# Altium project Ada4Arm.PrjPCB
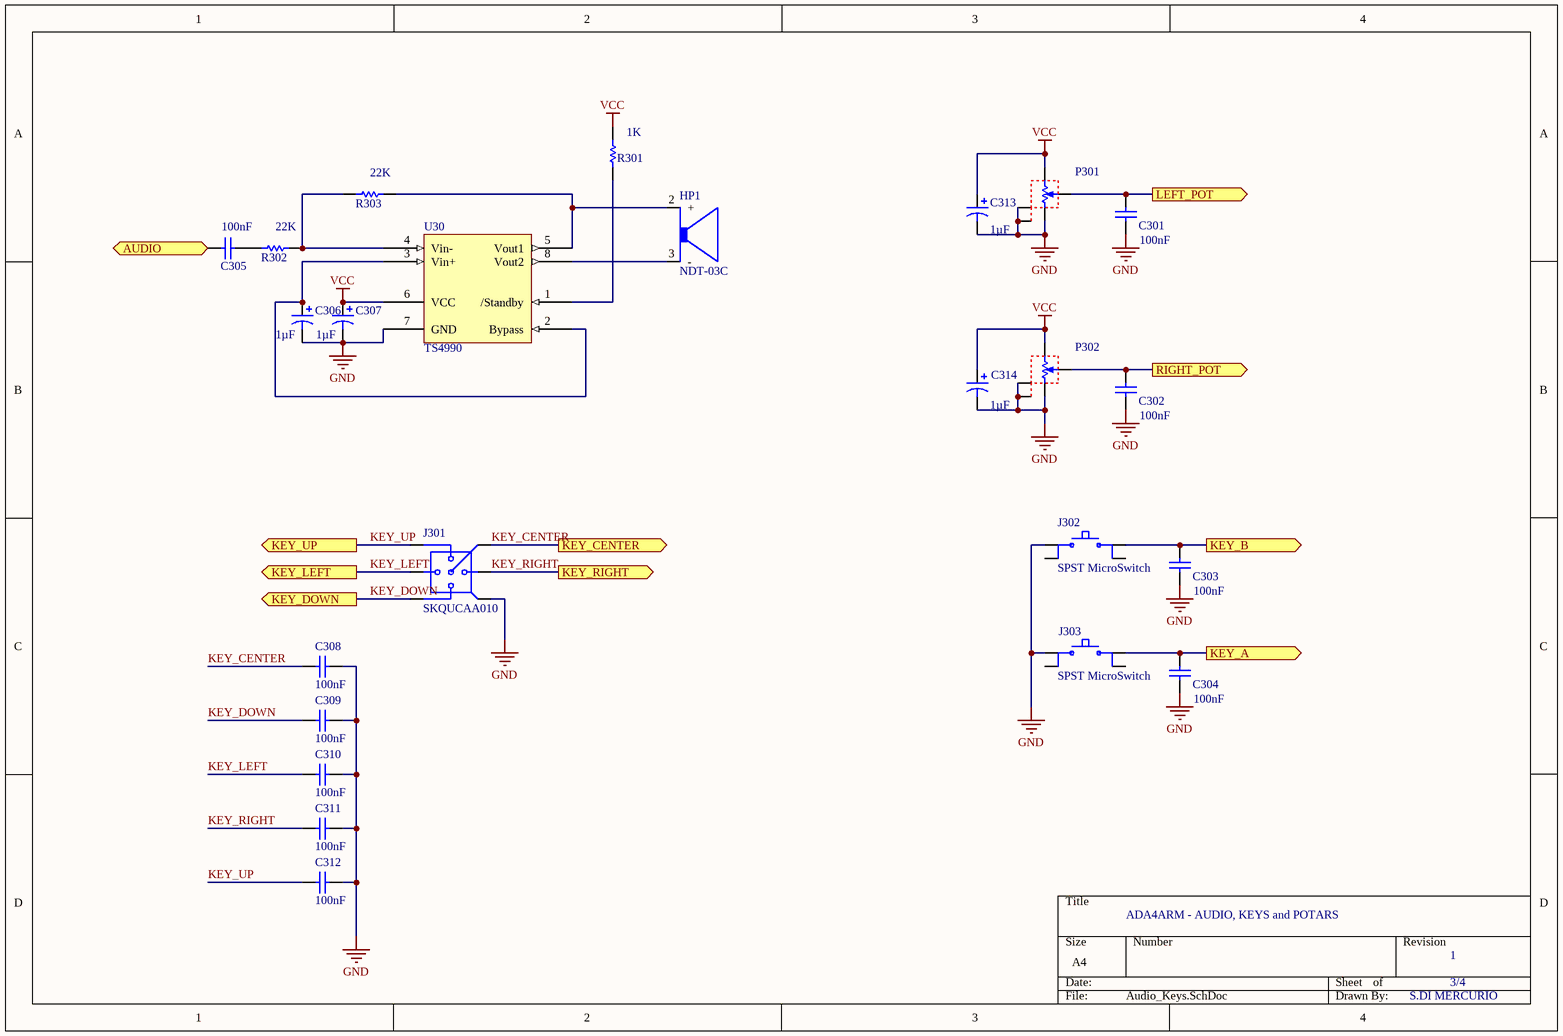
[diagram p0: Audio_Keys.SchDoc]
2 sheets, 41 parts. Net scope: flat (ports and power ports of the same name join across sheets).
Board file: PCB_Hammond_1591GSGY-v3B.PcbDoc
Sheets:
  Audio_Keys.SchDoc
  Power_Debug.SchDoc

## Sheet Audio_Keys.SchDoc
size A4

### Parts
C301  value 100nF  [CAPC1206(3216)100_N]  (hidden comment: CAP 100nF 16V 1206(3216))
C302  value 100nF  [CAPC1206(3216)100_N]  (hidden comment: CAP 100nF 16V 1206(3216))
C303  value 100nF  [CAPC1206(3216)100_N]  (hidden comment: CAP 100nF 16V 1206(3216))
C304  value 100nF  [CAPC1206(3216)100_N]  (hidden comment: CAP 100nF 16V 1206(3216))
C305  value 100nF  [CAPC1206(3216)100_N]  (hidden comment: CAP 100nF 16V 1206(3216))
C306  value 1µF  [EAI 3216-18 A]  (hidden comment: Cap Pol3)
C307  value 1µF  [EAI 3216-18 A]  (hidden comment: Cap Pol3)
C308  value 100nF  [CAPC1206(3216)100_N]  (hidden comment: CAP 100nF 16V 1206(3216))
C309  value 100nF  [CAPC1206(3216)100_N]  (hidden comment: CAP 100nF 16V 1206(3216))
C310  value 100nF  [CAPC1206(3216)100_N]  (hidden comment: CAP 100nF 16V 1206(3216))
C311  value 100nF  [CAPC1206(3216)100_N]  (hidden comment: CAP 100nF 16V 1206(3216))
C312  value 100nF  [CAPC1206(3216)100_N]  (hidden comment: CAP 100nF 16V 1206(3216))
C313  value 1µF  [EAI 3216-18 A]  (hidden comment: Cap Pol3)
C314  value 1µF  [EAI 3216-18 A]  (hidden comment: Cap Pol3)
HP1  NDT-03C  [KAAG15008C]
J301  SKQUCAA010  [SKQUCAA010]
J302  SPST MicroSwitch  [SPST_MicroSwitch]
J303  SPST MicroSwitch  [SPST_MicroSwitch]
P301  POT Type 51  [POT Type 51]  (value not drawn)
P302  POT Type 51  [POT Type 51]  (value not drawn)
R301  1K  [RESC1206(3216)_L]
R302  22K  [RESC1206(3216)_L]
R303  22K  [RESC1206(3216)_L]
U30  TS4990  [MiniSOP-8]

### Ports
AUDIO (in), KEY_A (out), KEY_B (out), KEY_CENTER (out), KEY_DOWN (out), KEY_LEFT (out), KEY_RIGHT (out), KEY_UP (out), LEFT_POT (out), RIGHT_POT (out)

### Nets
GND: C301.1 C302.1 C303.1 C304.1 C306.2 C307.2 C308.2 C309.2 C310.2 C311.2 C312.2 C313.2 C314.2 J301.4(COMMON) J302.1 J303.1 P301.3 P301.4(GND) P301.5(GND) P302.3 P302.4(GND) P302.5(GND) U30.7(GND)
VCC: C307.1 C313.1 C314.1 P301.1 P302.1 R301.2 U30.6(VCC)
KEY_CENTER: C308.1 J301.6(CENTER) ; port KEY_CENTER
KEY_DOWN: C309.1 J301.3(DOWN) ; port KEY_DOWN
KEY_LEFT: C310.1 J301.2(LEFT) ; port KEY_LEFT
KEY_RIGHT: C311.1 J301.5(RIGHT) ; port KEY_RIGHT
KEY_UP: C312.1 J301.1(UP) ; port KEY_UP
NetC301_2: C301.2 P301.2 ; port LEFT_POT
NetC302_2: C302.2 P302.2 ; port RIGHT_POT
NetC303_2: C303.2 J302.3 ; port KEY_B
NetC304_2: C304.2 J303.3 ; port KEY_A
NetC305_1: C305.1 R302.1
NetC305_2: C305.2 ; port AUDIO
NetC306_1: C306.1 U30.2(Bypass) U30.3(Vin+)
NetHP1_2: HP1.2(+) R303.2 U30.5(Vout1)
NetHP1_3: HP1.3(-) U30.8(Vout2)
NetR301_1: R301.1 U30.1(/Standby)
NetR302_2: R302.2 R303.1 U30.4(Vin-)

Not connected (* = marked no-connect by the designer): J302 2 4; J303 2 4

### Notes on the sheet
- ADA4ARM - AUDIO, KEYS and POTARS
- 1
- 3/4
- S.DI MERCURIO

### Library data of the parts
C301-C305 C308-C312 = CMP-1037-04185-1: CAP 100nF 16V -20% to +80% 1206 (3216 Metric) Thickness 1mm SMD; Case-EIA: 1206; Case-Metric: 3216; Max Thickness: 1 mm; Tolerance: -20% to +80%; Technology: SMT; Rated Voltage: 16 V
C306 C307 C313 C314 = Cap Pol3: Polarized Capacitor (Surface Mount); Published: 8-Jun-2000; LatestRevisionDate: 29-May-2009; LatestRevisionNote: IPC-7351 Footprint Added.; PackageReference: C0805; Publisher: Altium Limited; PackageDescription: Chip Capacitor
HP1 = NDT-03C: Audio HP
J301 = SKQUCAA010: 4 ways + center switch
J302 J303 = SPST MicroSwitch: SPST - MicroSwitch
P301 P302 = POT Type 51: 25mm Diameter potentiometer
R301-R303 = CMP-1014-00623-1: 10K 0.25W 1% 1206 (3216 Metric)  SMD; Case-Metric: 3216; Case-EIA: 1206; Power: 0.25 W; Technology: SMT; Tolerance: 1 %
  R301: Value: 1K
  R302 R303: Value: 22K

## Sheet Power_Debug.SchDoc
size A4
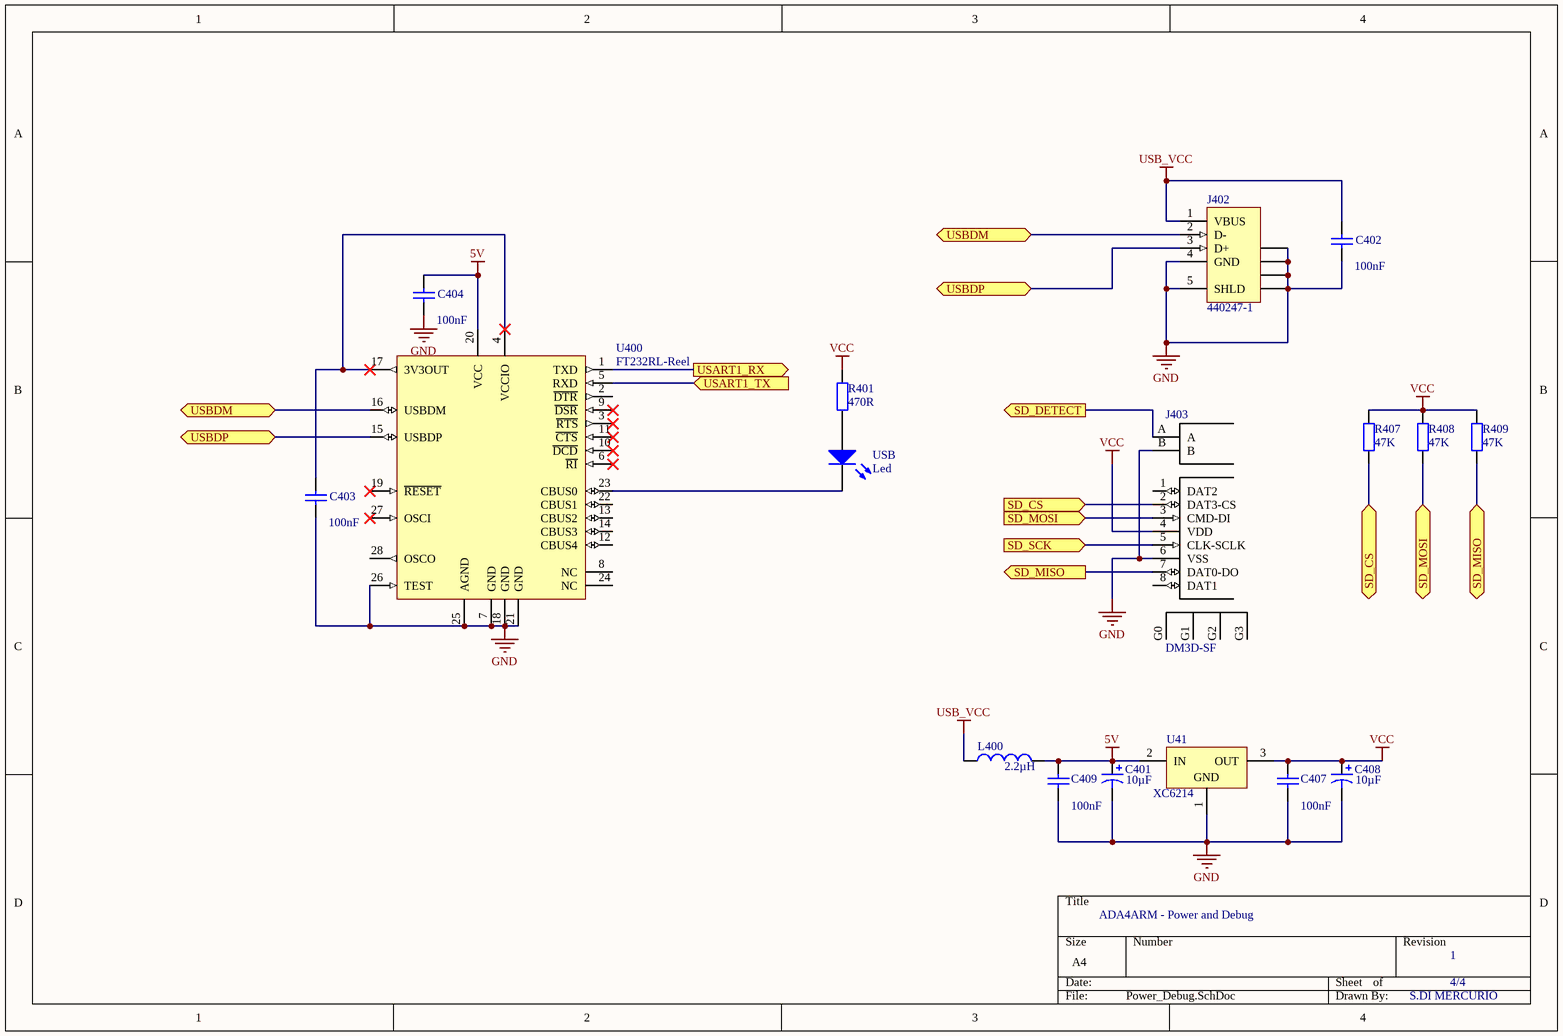
[diagram p1: Power_Debug.SchDoc]

### Parts
C401  value 10µF  [6032]  (hidden comment: Cap Pol3)
C402  value 100nF  [CAPC3216L]  (hidden comment: Cap Semi)
C403  value 100nF  [CAPC3216L]  (hidden comment: Cap Semi)
C404  value 100nF  [CAPC3216L]  (hidden comment: Cap Semi)
C407  value 100nF  [CAPC3216L]  (hidden comment: Cap Semi)
C408  value 10µF  [6032]  (hidden comment: Cap Pol3)
C409  value 100nF  [CAPC3216L]  (hidden comment: Cap Semi)
J402  440247-1  [440247]
J403  DM3D-SF  [DM3D-SF]
L400  value 2.2µH  [NPI43C]  (hidden comment: Inductor)
R401  value 470R  [RESC3216N]  (hidden comment: Res_EU)
R407  value 47K  [RESC3216N]  (hidden comment: 22R)
R408  value 47K  [RESC3216N]  (hidden comment: 22R)
R409  value 47K  [RESC3216N]  (hidden comment: 22R)
U41  XC6214  [SOT-89]
U400  FT232RL-Reel  [SSOP-28_N]
USB  Led  [OSRAM LO Q971]

### Ports
SD_CS, SD_CS (in), SD_DETECT (out), SD_MISO, SD_MISO (out), SD_MOSI, SD_MOSI (in), SD_SCK (in), USART1_RX (out), USART1_TX (in), USBDM (bidir), USBDP (bidir)

### Nets
5V: C401.1 C404.2 C409.2 L400.2 U41.2(IN) U400.20(VCC)
GND: C401.2 C402.1 C403.1 C404.1 C407.1 C408.2 C409.1 J402.4(GND) J402.5(SHLD) J402.6(SHLD) J402.7(SHLD) J402.8(SHLD) J402.9(SHLD) J403.6(VSS) J403.B U41.1(GND) U400.7(GND) U400.18(GND) U400.21(GND) U400.25(AGND) U400.26(TEST)
USB_VCC: C402.2 J402.1(VBUS) L400.1
VCC: C407.2 C408.1 J403.4(VDD) R401.1 R407.1 R408.1 R409.1 U41.3(OUT)
NetC403_2: C403.2 U400.4(VCCIO) U400.17(3V3OUT)
NetJ402_2: J402.2(D-) U400.16(USBDM) ; port USBDM
NetJ402_3: J402.3(D+) U400.15(USBDP) ; port USBDP
NetJ403_2: J403.2(DAT3-CS) R407.2 ; port SD_CS
NetJ403_3: J403.3(CMD-DI) R408.2 ; port SD_MOSI
NetJ403_5: J403.5(CLK-SCLK) ; port SD_SCK
NetJ403_7: J403.7(DAT0-DO) R409.2 ; port SD_MISO
NetJ403_A: J403.A ; port SD_DETECT
NetR401_2: R401.2 USB.A
NetU400_1: U400.1(TXD) ; port USART1_RX
NetU400_5: U400.5(RXD) ; port USART1_TX
NetU400_23: U400.23(CBUS0) USB.K

Not connected (* = marked no-connect by the designer): J403 1(DAT2) 8(DAT1) G0(9) G1(10) G2(11) G3(12); U400 2(~{DTR}) 3(~{RTS})* 6(~{RI})* 8(NC) 9(~{DSR})* 10(~{DCD})* 11(~{CTS})* 12(CBUS4) 13(CBUS2) 14(CBUS3) 19(~{RESET})* 22(CBUS1) 24(NC) 27(OSCI)* 28(OSCO)

### Notes on the sheet
- ADA4ARM - Power and Debug
- 1
- 4/4
- S.DI MERCURIO

### Library data of the parts
C401 C408 = Cap Pol3: Polarized Capacitor (Surface Mount); Published: 8-Jun-2000; LatestRevisionDate: 29-May-2009; LatestRevisionNote: IPC-7351 Footprint Added.; PackageReference: C0805; Publisher: Altium Limited; PackageDescription: Chip Capacitor
C402-C404 C407 C409 = Cap Semi: Capacitor (Semiconductor SIM Model); Published: 8-Jun-2000; LatestRevisionDate: 29-May-2009; LatestRevisionNote: IPC-7351 Footprint Added.; PackageReference: C1206; Publisher: Altium Limited; PackageDescription: Chip Capacitor
J402 = 440247-1: USB 2.0, Right Angle, SMT, B Type, Receptacle, 5 Position, Black; ContactMaterial: Copper Alloy; ContactPlating: Gold (30); PCB_Layout: Complies with manufacturer's recommendation.; DrillSize: Corresponds to nominal value.; PanelGround: Without; Published: 15-Jul-2004; DatasheetDocument: 27-Jun-2003; PackageDocument: 27-Jun-2003; PackageReference: 440247; Publisher: Altium Limited; HousingMaterial: Thermoplastic; ComponentLink1Description: Manufacturer Link; ComponentLink1URL: http://www.tycoelectronics.com/; ComponentLink2Description: Packaging Specification; ComponentLink2URL: http://ecommas.tycoelectronics.com/commerce/DocumentDelivery/DDEController?Action=showdoc&DocId=Customer+Drawing%7F440247%7FD%7Fpdf%7FEnglish%7FC_440247_D.pdf
L400 = Inductor: Inductor SMD; Code_IEC: 1005; Published: 8-Jun-2000; LatestRevisionDate: 29-May-2009; LatestRevisionNote: IPC-7351 Footprint Added.; PackageReference: 0402-A; Publisher: Altium Limited; PackageDescription: Chip Inductor; Code_JEITA: 0402
R401 R407-R409 = Res_EU: Resistor; Published: 8-Jun-2000; LatestRevisionDate: 17-Jul-2002; LatestRevisionNote: Re-released for DXP Platform.; PackageReference: AXIAL-0.4; Publisher: Altium Limited
U41 = XC6214: Fixed LDO regulator
U400 = FT232RL-Reel: USB UART Asynchronous Serial Data Transfer Chip, SSOP-28, Tape and Reel; Published: 19-Aug-2010; DatasheetVersion: ver 2.07, Jul-2010; PackageVersion: 2010; PackageReference: SSOP-28; Publisher: Altium Limited; PackageDescription: 28-Pin Small Outline Package 0.65 mm Pitch; ComponentLink1Description: Manufacturer Link; ComponentLink1URL: http://www.ftdichip.com/Products/ICs/FT232R.htm; ComponentLink2Description: Datasheet; ComponentLink2URL: http://www.ftdichip.com/Support/Documents/DataSheets/ICs/DS_FT232R.pdf

## Nets that join several sheets
GND: Audio_Keys (23 pins), Power_Debug (21 pins)
VCC: Audio_Keys (7 pins), Power_Debug (8 pins)